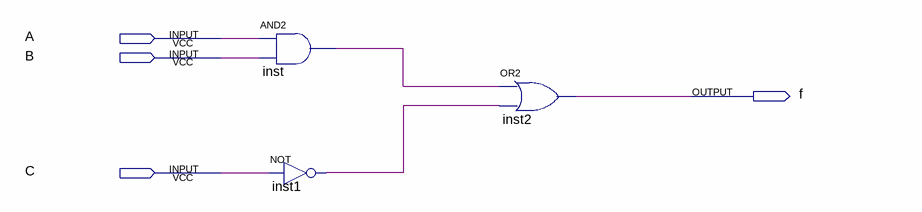
[diagram p0: schematic sheet]
// Quartus schematic lab2c.bdf as structural Verilog: 3 symbols, 4 pins
module lab2c (
  input  A,
  input  B,
  input  C,
  output f
);

  wire inst1_out, inst_out;

  and inst (inst_out, A, B);
  not inst1 (inst1_out, C);
  or inst2 (f, inst_out, inst1_out);
endmodule
